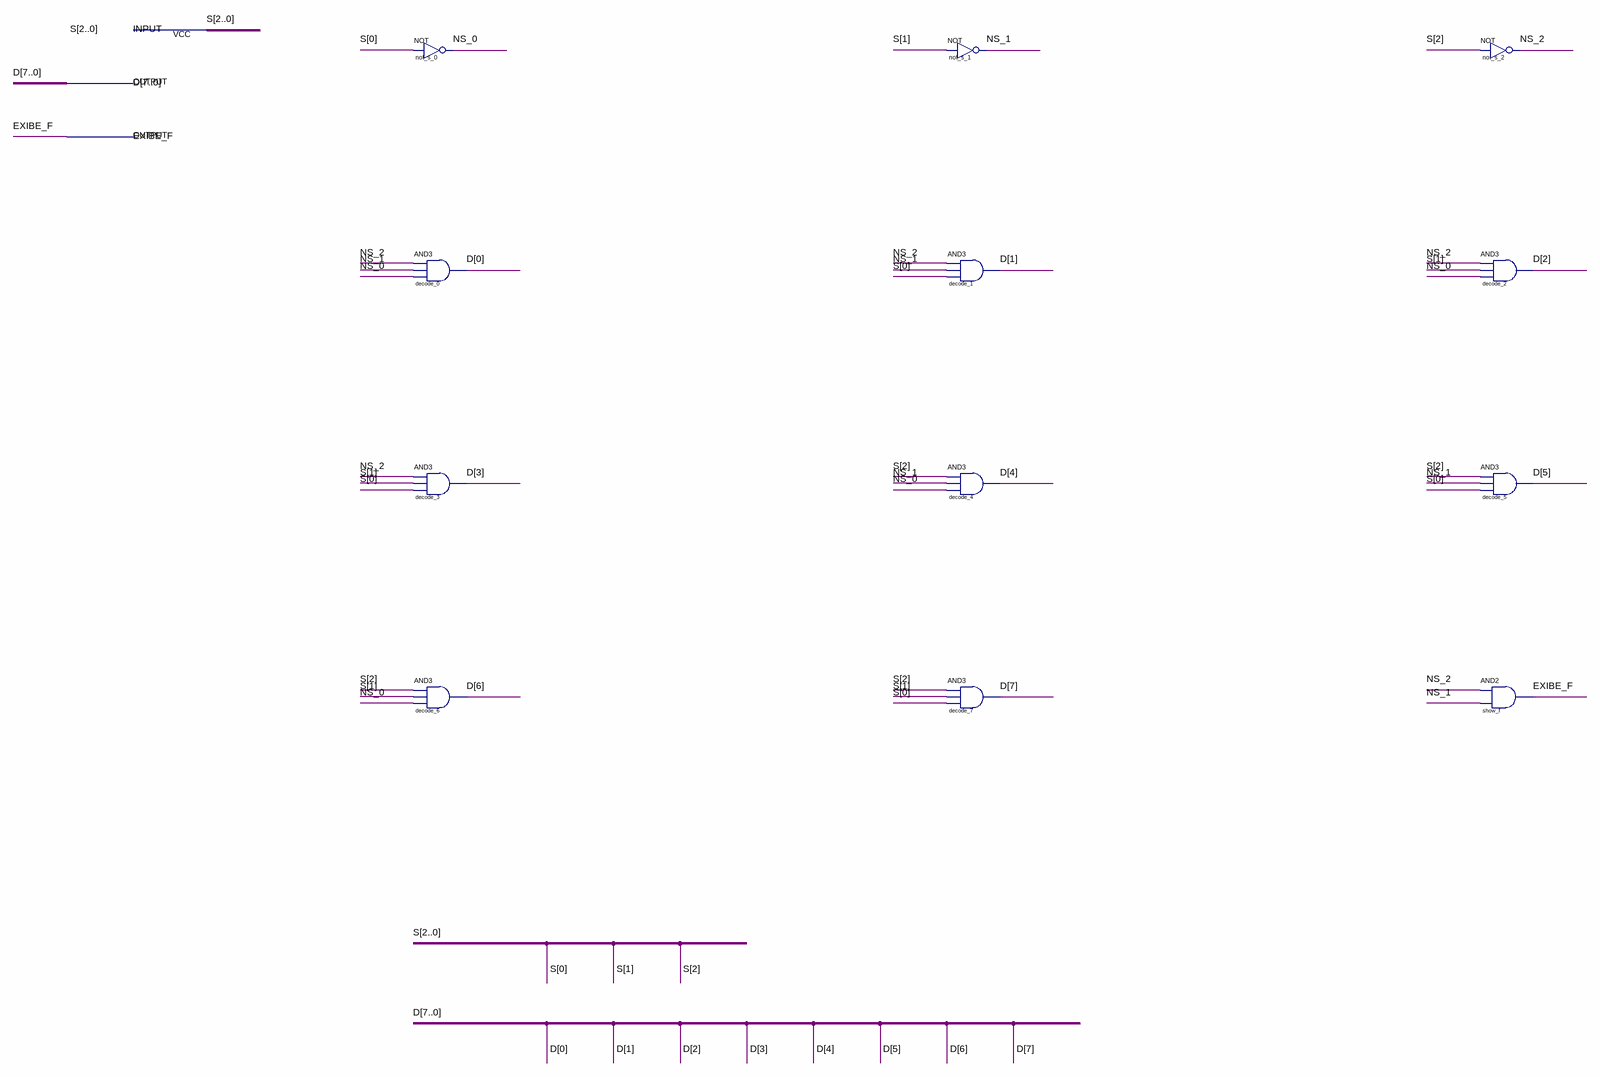
[diagram p0: schematic sheet]
// Quartus schematic decodificador_operacao.bdf as structural Verilog: 12 symbols, 3 pins
module decodificador_operacao (
  input  [2:0] S,
  output [7:0] D,
  output EXIBE_F
);

  wire NS_0, NS_1, NS_2;

  not not_s_0 (NS_0, S[0]);
  and decode_0 (D[0], NS_2, NS_1, NS_0);
  and decode_3 (D[3], NS_2, S[1], S[0]);
  and decode_6 (D[6], S[2], S[1], NS_0);
  not not_s_1 (NS_1, S[1]);
  and decode_1 (D[1], NS_2, NS_1, S[0]);
  and decode_4 (D[4], S[2], NS_1, NS_0);
  and decode_7 (D[7], S[2], S[1], S[0]);
  not not_s_2 (NS_2, S[2]);
  and decode_2 (D[2], NS_2, S[1], NS_0);
  and decode_5 (D[5], S[2], NS_1, S[0]);
  and show_f (EXIBE_F, NS_2, NS_1);
endmodule
